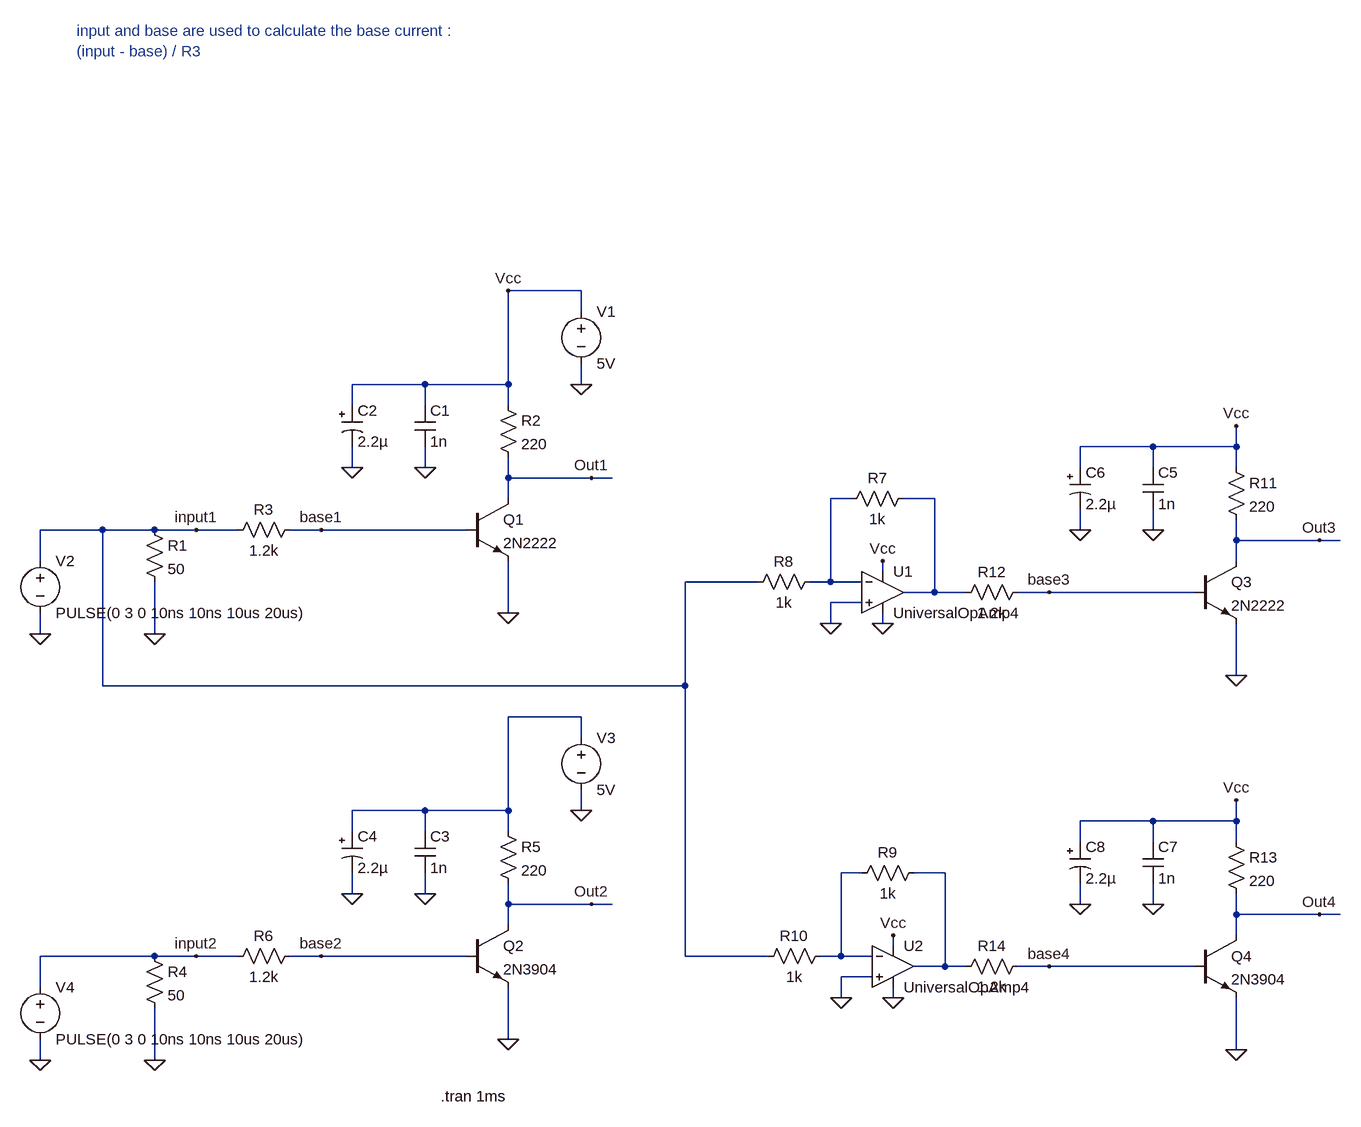
[diagram p0: schematic TransistorsCompare.asc]
TransistorsCompare.asc, the LTspice schematic file:
Version 4
SHEET 1 1724 1112
WIRE 544 -144 432 -144
WIRE 544 -112 544 -144
WIRE 304 0 192 0
WIRE 432 0 432 -144
WIRE 432 0 304 0
WIRE 544 0 544 -32
WIRE 192 32 192 0
WIRE 304 32 304 0
WIRE 432 32 432 0
WIRE 1424 96 1312 96
WIRE 1552 96 1552 64
WIRE 1552 96 1424 96
WIRE 192 128 192 96
WIRE 304 128 304 96
WIRE 1312 128 1312 96
WIRE 1424 128 1424 96
WIRE 1552 128 1552 96
WIRE 432 144 432 112
WIRE 560 144 432 144
WIRE 592 144 560 144
WIRE 432 176 432 144
WIRE 960 176 928 176
WIRE 1088 176 1040 176
WIRE -192 224 -288 224
WIRE -112 224 -192 224
WIRE -48 224 -112 224
WIRE 16 224 -48 224
WIRE 144 224 96 224
WIRE 368 224 144 224
WIRE 1312 224 1312 192
WIRE 1424 224 1424 192
WIRE 1552 240 1552 208
WIRE 1680 240 1552 240
WIRE 1712 240 1680 240
WIRE -288 272 -288 224
WIRE 1552 272 1552 240
WIRE 1008 288 1008 272
WIRE 816 304 704 304
WIRE 928 304 928 176
WIRE 928 304 896 304
WIRE 976 304 928 304
WIRE 1088 320 1088 176
WIRE 1088 320 1040 320
WIRE 1136 320 1088 320
WIRE 1264 320 1216 320
WIRE 1488 320 1264 320
WIRE 976 336 928 336
WIRE 432 352 432 272
WIRE 928 368 928 336
WIRE 1008 368 1008 352
WIRE -288 384 -288 352
WIRE -112 384 -112 304
WIRE 1552 448 1552 368
WIRE -192 464 -192 224
WIRE 704 464 704 304
WIRE 704 464 -192 464
WIRE 544 512 432 512
WIRE 544 544 544 512
WIRE 304 656 192 656
WIRE 432 656 432 512
WIRE 432 656 304 656
WIRE 544 656 544 624
WIRE 1424 672 1312 672
WIRE 1552 672 1552 640
WIRE 1552 672 1424 672
WIRE 192 688 192 656
WIRE 304 688 304 656
WIRE 432 688 432 656
WIRE 1312 704 1312 672
WIRE 1424 704 1424 672
WIRE 1552 704 1552 672
WIRE 976 752 944 752
WIRE 1104 752 1056 752
WIRE 192 784 192 752
WIRE 304 784 304 752
WIRE 432 800 432 768
WIRE 560 800 432 800
WIRE 592 800 560 800
WIRE 1312 800 1312 768
WIRE 1424 800 1424 768
WIRE 1552 816 1552 784
WIRE 1680 816 1552 816
WIRE 1712 816 1680 816
WIRE 432 832 432 800
WIRE 1552 848 1552 816
WIRE 1024 864 1024 848
WIRE -112 880 -288 880
WIRE -48 880 -112 880
WIRE 16 880 -48 880
WIRE 144 880 96 880
WIRE 368 880 144 880
WIRE 704 880 704 464
WIRE 832 880 704 880
WIRE 944 880 944 752
WIRE 944 880 912 880
WIRE 992 880 944 880
WIRE 1104 896 1104 752
WIRE 1104 896 1056 896
WIRE 1136 896 1104 896
WIRE 1264 896 1216 896
WIRE 1488 896 1264 896
WIRE 992 912 944 912
WIRE -288 928 -288 880
WIRE 944 944 944 912
WIRE 1024 944 1024 928
WIRE 432 1008 432 928
WIRE 1552 1024 1552 944
WIRE -288 1040 -288 1008
WIRE -112 1040 -112 960
FLAG 432 352 0
FLAG -288 384 0
FLAG -112 384 0
FLAG 544 0 0
FLAG 304 128 0
FLAG 192 128 0
FLAG -48 224 input1
FLAG 144 224 base1
FLAG 560 144 Out1
FLAG 432 1008 0
FLAG -288 1040 0
FLAG -112 1040 0
FLAG 544 656 0
FLAG 304 784 0
FLAG 192 784 0
FLAG -48 880 input2
FLAG 144 880 base2
FLAG 560 800 Out2
FLAG 1008 368 0
FLAG 1024 944 0
FLAG 432 -144 Vcc
FLAG 1008 272 Vcc
FLAG 1024 848 Vcc
FLAG 928 368 0
FLAG 944 944 0
FLAG 1552 448 0
FLAG 1424 224 0
FLAG 1312 224 0
FLAG 1264 320 base3
FLAG 1680 240 Out3
FLAG 1552 64 Vcc
FLAG 1552 1024 0
FLAG 1424 800 0
FLAG 1312 800 0
FLAG 1264 896 base4
FLAG 1680 816 Out4
FLAG 1552 640 Vcc
SYMBOL voltage 544 -128 R0
WINDOW 123 0 0 Left 0
WINDOW 39 0 0 Left 0
SYMATTR InstName V1
SYMATTR Value 5V
SYMBOL voltage -288 256 R0
WINDOW 123 0 0 Left 0
WINDOW 39 0 0 Left 0
SYMATTR InstName V2
SYMATTR Value PULSE(0 3 0 10ns 10ns 10us 20us)
SYMBOL res -128 208 R0
SYMATTR InstName R1
SYMATTR Value 50
SYMBOL res 416 16 R0
SYMATTR InstName R2
SYMATTR Value 220
SYMBOL res 112 208 R90
WINDOW 0 0 56 VBottom 2
WINDOW 3 32 56 VTop 2
SYMATTR InstName R3
SYMATTR Value 1.2k
SYMBOL cap 288 32 R0
SYMATTR InstName C1
SYMATTR Value 1n
SYMBOL polcap 176 32 R0
WINDOW 3 24 56 Left 2
SYMATTR Value 2.2µ
SYMATTR InstName C2
SYMATTR Description Capacitor
SYMATTR Type cap
SYMATTR SpiceLine V=35 Irms=8.4m Rser=1.5 Lser=550f mfg="Würth Elektronik" pn="865250540001 WCAP-ASNP 4.3x4.3" type="Al electrolytic"
SYMBOL npn 368 176 R0
SYMATTR InstName Q1
SYMATTR Value 2N2222
SYMBOL voltage 544 528 R0
WINDOW 123 0 0 Left 0
WINDOW 39 0 0 Left 0
SYMATTR InstName V3
SYMATTR Value 5V
SYMBOL voltage -288 912 R0
WINDOW 123 0 0 Left 0
WINDOW 39 0 0 Left 0
SYMATTR InstName V4
SYMATTR Value PULSE(0 3 0 10ns 10ns 10us 20us)
SYMBOL res -128 864 R0
SYMATTR InstName R4
SYMATTR Value 50
SYMBOL res 416 672 R0
SYMATTR InstName R5
SYMATTR Value 220
SYMBOL res 112 864 R90
WINDOW 0 0 56 VBottom 2
WINDOW 3 32 56 VTop 2
SYMATTR InstName R6
SYMATTR Value 1.2k
SYMBOL cap 288 688 R0
SYMATTR InstName C3
SYMATTR Value 1n
SYMBOL polcap 176 688 R0
WINDOW 3 24 56 Left 2
SYMATTR Value 2.2µ
SYMATTR InstName C4
SYMATTR Description Capacitor
SYMATTR Type cap
SYMATTR SpiceLine V=35 Irms=8.4m Rser=1.5 Lser=550f mfg="Würth Elektronik" pn="865250540001 WCAP-ASNP 4.3x4.3" type="Al electrolytic"
SYMBOL npn 368 832 R0
SYMATTR InstName Q2
SYMATTR Value 2N3904
SYMBOL OpAmps\\UniversalOpAmp4 1008 320 R0
SYMATTR InstName U1
SYMBOL OpAmps\\UniversalOpAmp4 1024 896 R0
SYMATTR InstName U2
SYMBOL res 1056 160 R90
WINDOW 0 0 56 VBottom 2
WINDOW 3 32 56 VTop 2
SYMATTR InstName R7
SYMATTR Value 1k
SYMBOL res 912 288 R90
WINDOW 0 0 56 VBottom 2
WINDOW 3 32 56 VTop 2
SYMATTR InstName R8
SYMATTR Value 1k
SYMBOL res 1072 736 R90
WINDOW 0 0 56 VBottom 2
WINDOW 3 32 56 VTop 2
SYMATTR InstName R9
SYMATTR Value 1k
SYMBOL res 928 864 R90
WINDOW 0 0 56 VBottom 2
WINDOW 3 32 56 VTop 2
SYMATTR InstName R10
SYMATTR Value 1k
SYMBOL res 1536 112 R0
SYMATTR InstName R11
SYMATTR Value 220
SYMBOL res 1232 304 R90
WINDOW 0 0 56 VBottom 2
WINDOW 3 32 56 VTop 2
SYMATTR InstName R12
SYMATTR Value 1.2k
SYMBOL cap 1408 128 R0
SYMATTR InstName C5
SYMATTR Value 1n
SYMBOL polcap 1296 128 R0
WINDOW 3 24 56 Left 2
SYMATTR Value 2.2µ
SYMATTR InstName C6
SYMATTR Description Capacitor
SYMATTR Type cap
SYMATTR SpiceLine V=35 Irms=8.4m Rser=1.5 Lser=550f mfg="Würth Elektronik" pn="865250540001 WCAP-ASNP 4.3x4.3" type="Al electrolytic"
SYMBOL npn 1488 272 R0
SYMATTR InstName Q3
SYMATTR Value 2N2222
SYMBOL res 1536 688 R0
SYMATTR InstName R13
SYMATTR Value 220
SYMBOL cap 1408 704 R0
SYMATTR InstName C7
SYMATTR Value 1n
SYMBOL polcap 1296 704 R0
WINDOW 3 24 56 Left 2
SYMATTR Value 2.2µ
SYMATTR InstName C8
SYMATTR Description Capacitor
SYMATTR Type cap
SYMATTR SpiceLine V=35 Irms=8.4m Rser=1.5 Lser=550f mfg="Würth Elektronik" pn="865250540001 WCAP-ASNP 4.3x4.3" type="Al electrolytic"
SYMBOL npn 1488 848 R0
SYMATTR InstName Q4
SYMATTR Value 2N3904
SYMBOL res 1232 880 R90
WINDOW 0 0 56 VBottom 2
WINDOW 3 32 56 VTop 2
SYMATTR InstName R14
SYMATTR Value 1.2k
TEXT -232 -544 Left 2 ;input and base are used to calculate the base current :\n(input - base) / R3
TEXT 328 1096 Left 2 !.tran 1ms

The netlist it stands for:
* TransistorsCompare.asc
V1 Vcc 0 5V
V2 input1 0 PULSE(0 3 0 10ns 10ns 10us 20us)
R1 input1 0 50
R2 Vcc Out1 220
R3 base1 input1 1.2k
C1 Vcc 0 1n
C2 Vcc 0 2.2µ V=35 Irms=8.4m Rser=1.5 Lser=550f mfg="Würth Elektronik" pn="865250540001 WCAP-ASNP 4.3x4.3" type="Al electrolytic"
Q1 Out1 base1 0 0 2N2222
V3 N003 0 5V
V4 input2 0 PULSE(0 3 0 10ns 10ns 10us 20us)
R4 input2 0 50
R5 N003 Out2 220
R6 base2 input2 1.2k
C3 N003 0 1n
C4 N003 0 2.2µ V=35 Irms=8.4m Rser=1.5 Lser=550f mfg="Würth Elektronik" pn="865250540001 WCAP-ASNP 4.3x4.3" type="Al electrolytic"
Q2 Out2 base2 0 0 2N3904
* U1: UniversalOpAmp4 (symbol OpAmps\UniversalOpAmp4 not available, pins judged from their places): In+=0 In-=N001 V+=Vcc V-=0 OUT=N002
* U2: UniversalOpAmp4 (symbol OpAmps\UniversalOpAmp4 not available, pins judged from their places): In+=0 In-=N004 V+=Vcc V-=0 OUT=N005
R7 N002 N001 1k
R8 N001 input1 1k
R9 N005 N004 1k
R10 N004 input1 1k
R11 Vcc Out3 220
R12 base3 N002 1.2k
C5 Vcc 0 1n
C6 Vcc 0 2.2µ V=35 Irms=8.4m Rser=1.5 Lser=550f mfg="Würth Elektronik" pn="865250540001 WCAP-ASNP 4.3x4.3" type="Al electrolytic"
Q3 Out3 base3 0 0 2N2222
R13 Vcc Out4 220
C7 Vcc 0 1n
C8 Vcc 0 2.2µ V=35 Irms=8.4m Rser=1.5 Lser=550f mfg="Würth Elektronik" pn="865250540001 WCAP-ASNP 4.3x4.3" type="Al electrolytic"
Q4 Out4 base4 0 0 2N3904
R14 base4 N005 1.2k
.model NPN NPN
.model PNP PNP
.lib standard.bjt
* input and base are used to calculate the base current :
* (input - base) / R3
.tran 1ms
.backanno
.end